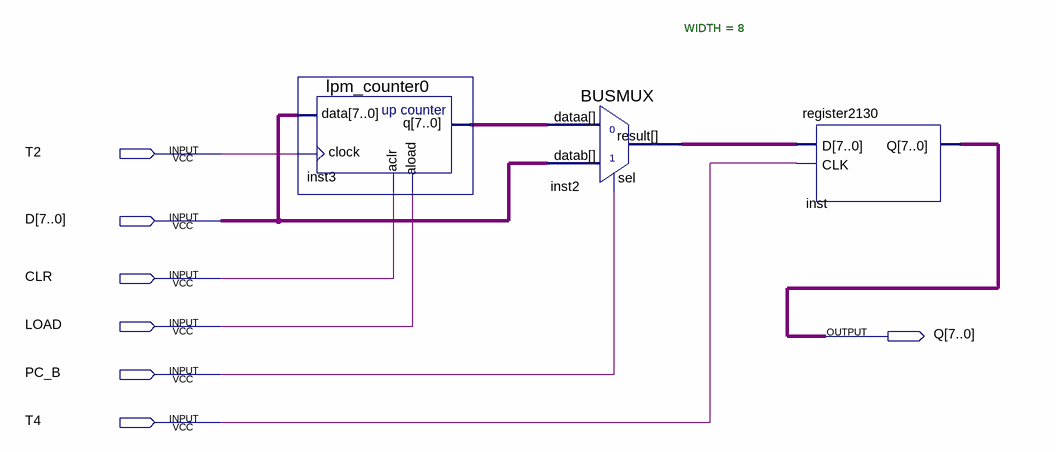
[diagram p0: schematic sheet]
// Quartus schematic PC_AR2130.bdf as structural Verilog: 3 symbols, 7 pins
module PC_AR2130 (
  input  T2,
  input  [7:0] D,
  input  CLR,
  input  LOAD,
  input  PC_B,
  input  T4,
  output [7:0] Q
);

  wire [7:0] inst2_result, inst3_q;

  lpm_counter0 inst3 (.data(D), .clock(T2), .aclr(CLR), .aload(LOAD), .q(inst3_q));
  BUSMUX #(.WIDTH(8)) inst2 (.datab(D), .sel(PC_B), .dataa(inst3_q), .result(inst2_result));
  register2130 inst (.D(inst2_result), .CLK(T4), .Q(Q));
endmodule
